# EAGLE schematic AtariST microATX (EAGLE 7.7.0)

## Sheet 1 of 3
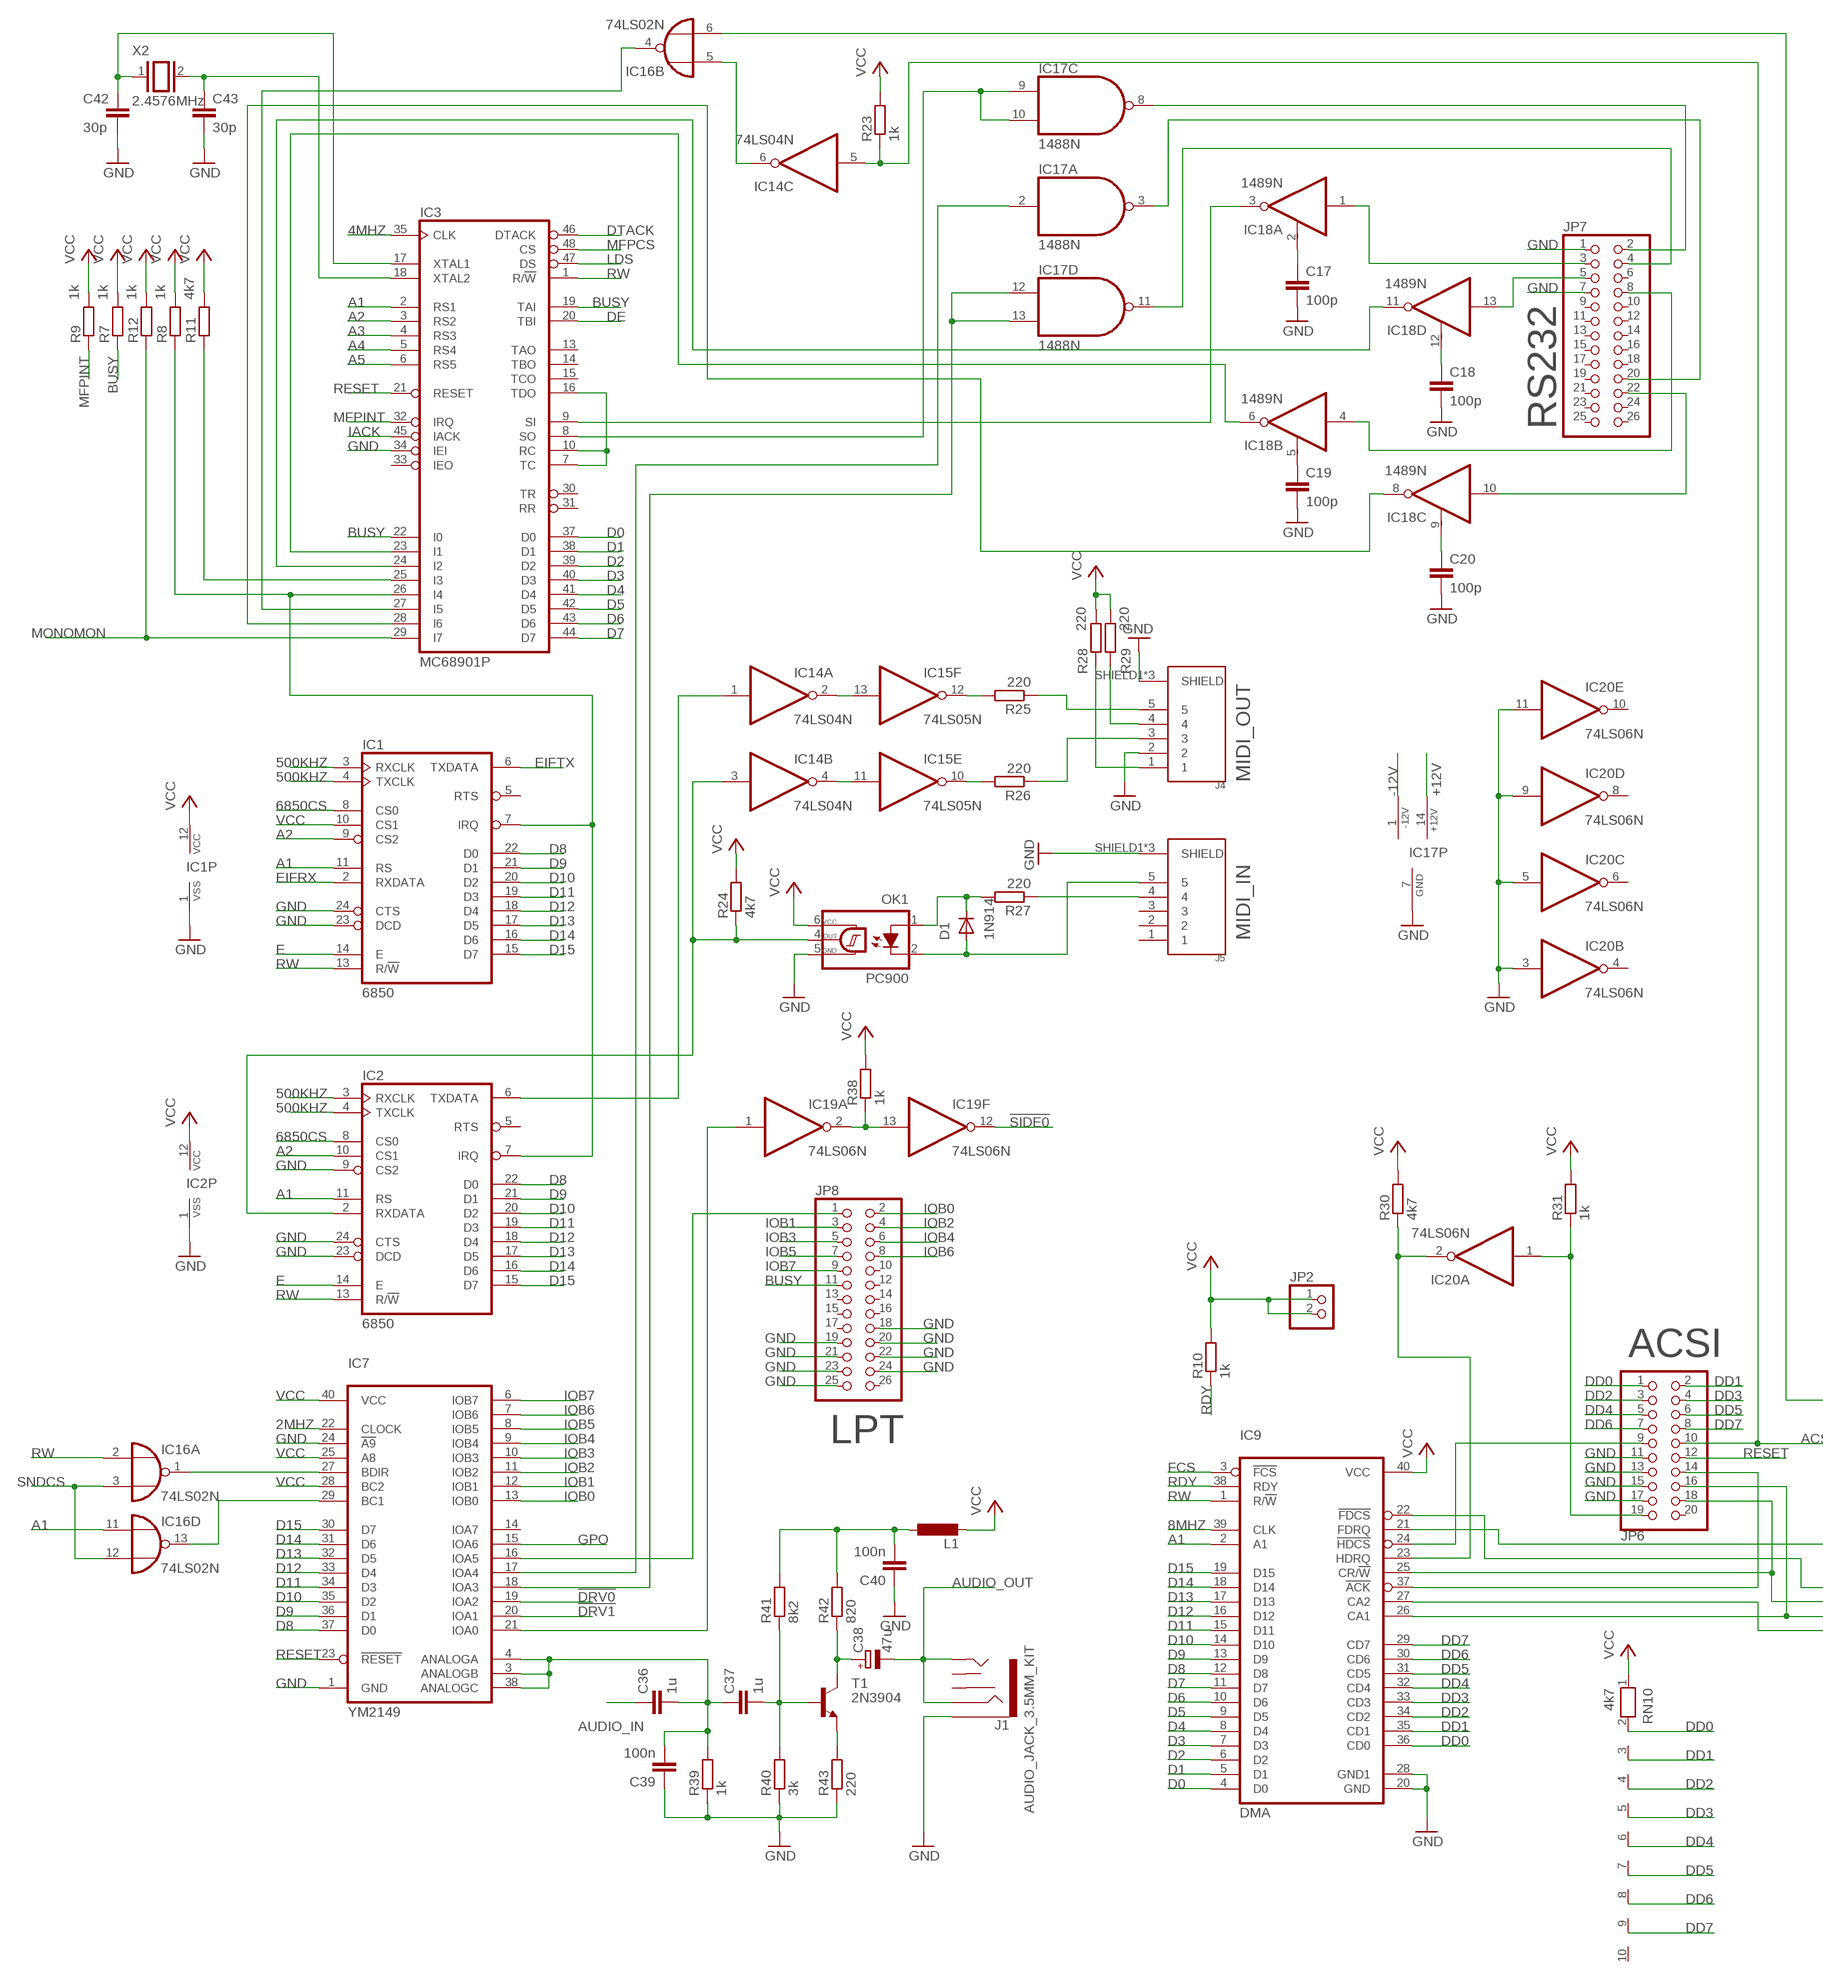
[diagram p0: schematic, sheet 1, part 1 of 2]
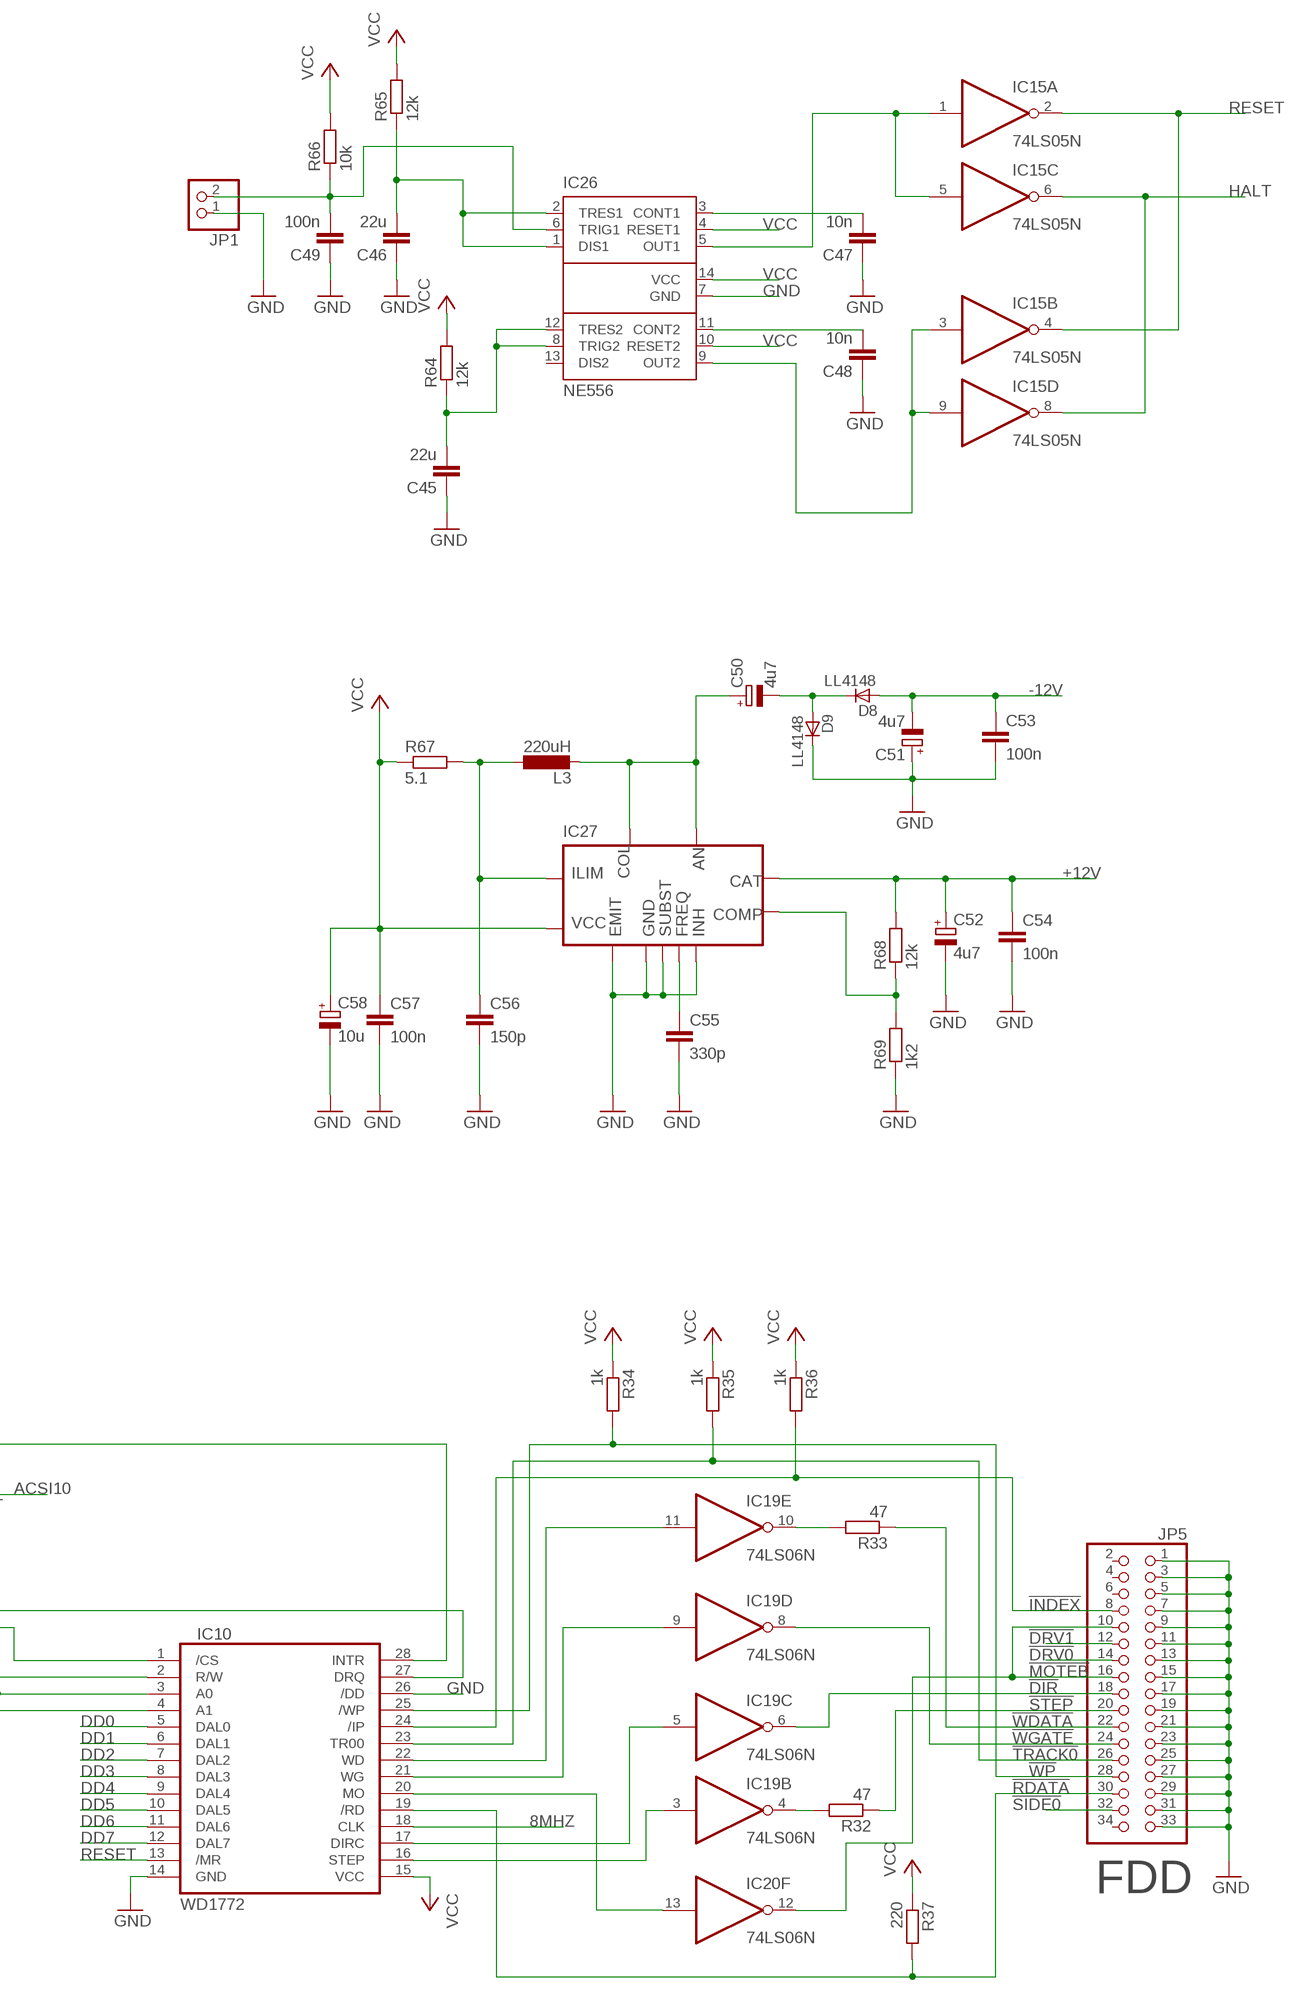
[diagram p1: schematic, sheet 1, part 2 of 2]

### Parts
C17  100p  C-EUC0805  [C0805]
C18  100p  C-EUC0805  [C0805]
C19  100p  C-EUC0805  [C0805]
C20  100p  C-EUC0805  [C0805]
C36  1u  C-EUC0805  [C0805]
C37  1u  C-EUC0805  [C0805]
C38  47u  CPOL-EUE2-5  [E2-5]
C39  100n  C-EUC0805  [C0805]
C40  100n  C-EUC0805  [C0805]
C42  30p  C-EUC0805  [C0805]
C43  30p  C-EUC0805  [C0805]
C45  22u  C-EUC1206  [C1206]
C46  22u  C-EUC1206  [C1206]
C47  10n  C-EUC0805  [C0805]
C48  10n  C-EUC0805  [C0805]
C49  100n  C-EUC0805  [C0805]
C50  4u7  CPOL-EUE2-5  [E2-5]
C51  4u7  CPOL-EUE2-5  [E2-5]
C52  4u7  CPOL-EUE2-5  [E2-5]
C53  100n  C-EUC0805  [C0805]
C54  100n  C-EUC0805  [C0805]
C55  330p  C-EUC0805  [C0805]
C56  150p  C-EUC0805  [C0805]
C57  100n  C-EUC0805  [C0805]
C58  10u  CPOL-EUE2-5  [E2-5]
D1  1N914  BAV17  [DO35-10]
D8  LL4148  [SOD80_DO213AA_MINIMELF]
D9  LL4148  [SOD80_DO213AA_MINIMELF]
IC1  6850  [DIL24]
IC2  6850  [DIL24]
IC3  MC68901P  [DIL48]
IC7  YM2149  [DIL40]
IC9  DMA  [DIL40]
IC10  WD1772  [DIL28]
IC14  74LS04N  [DIL14]
IC15  74LS05N  [DIL14]
IC16  74LS02N  [DIL14]
IC17  1488N  [DIL14]
IC18  1489N  [DIL14]
IC19  74LS06N  [DIL14]
IC20  74LS06N  [DIL14]
IC26  NE556  [DIL14]
IC27  TL497  [DIL14]
J1  AUDIO_JACK_3.5MM_KIT  [AUDIO-JACK-KIT]
J4  MIDI_OUT  DIN5  [DIN5]
J5  MIDI_IN  DIN5  [DIN5]
JP1  PINHD-1X2  [1X02]
JP2  PINHD-1X2  [1X02]
JP5  PINHD-2X17  [2X17]
JP6  PINHD-2X10  [2X10]
JP7  RS232  PINHD-2X13  [2X13]
JP8  LPT  PINHD-2X13  [2X13]
L1  L-EU0204/7  [0204/7]
L3  220uH  L-EU0204/7  [0204/7]
OK1  PC900  H11L1M  [DIL06]
R7  1k  R-EU_R0805  [R0805]
R8  1k  R-EU_R0805  [R0805]
R9  1k  R-EU_R0805  [R0805]
R10  1k  R-EU_R0805  [R0805]
R11  4k7  R-EU_R0805  [R0805]
R12  1k  R-EU_R0805  [R0805]
R23  1k  R-EU_R0805  [R0805]
R24  4k7  R-EU_R0805  [R0805]
R25  220  R-EU_R0805  [R0805]
R26  220  R-EU_R0805  [R0805]
R27  220  R-EU_R0805  [R0805]
R28  220  R-EU_R0805  [R0805]
R29  220  R-EU_R0805  [R0805]
R30  4k7  R-EU_R0805  [R0805]
R31  1k  R-EU_R0805  [R0805]
R32  47  R-EU_0204/5  [0204/5]
R33  47  R-EU_0204/5  [0204/5]
R34  1k  R-EU_R0805  [R0805]
R35  1k  R-EU_R0805  [R0805]
R36  1k  R-EU_R0805  [R0805]
R37  220  R-EU_R0805  [R0805]
R38  1k  R-EU_R0805  [R0805]
R39  1k  R-EU_R0805  [R0805]
R40  3k  R-EU_R0805  [R0805]
R41  8k2  R-EU_R0805  [R0805]
R42  820  R-EU_R0805  [R0805]
R43  220  R-EU_R0805  [R0805]
R64  12k  R-EU_R0805  [R0805]
R65  12k  R-EU_R0805  [R0805]
R66  10k  R-EU_R0805  [R0805]
R67  5.1  R-EU_0204/7  [0204/7]
R68  12k  R-EU_R0805  [R0805]
R69  1k2  R-EU_R0805  [R0805]
RN10  4k7  RN09  [RN-10]
T1  2N3904  [TO92]
X2  2.4576MHz  XTAL/S  [QS]

### Nets
2MHZ: IC7.22(CLOCK) ; also sheet 2
4MHZ: IC3.35(CLK) ; also sheet 2
8MHZ: IC9.39(CLK) IC10.18(CLK) ; also sheet 2,3
500KHZ: IC1.3(RXCLK) IC1.4(TXCLK) IC2.3(RXCLK) IC2.4(TXCLK) ; also sheet 2
6850CS: IC1.8(CS0) IC2.8(CS0) ; also sheet 2
!DIR: IC19.6(C:O) JP5.18
!DRV0: IC7.19(IOA2) JP5.14
!DRV1: IC7.20(IOA1) JP5.12
!INDEX: IC10.24(/IP) JP5.8 R36.2
!MOTEB: IC20.12(F:O) JP5.10 JP5.16
!RDATA: IC10.19(/RD) JP5.30 R37.2
!SIDE0: IC19.12(F:O) JP5.32
!STEP: JP5.20 R32.1
!TRACK0: IC10.23(TR00) JP5.26 R35.2
!WDATA: JP5.22 R33.1
!WGATE: IC19.8(D:O) JP5.24
!WP: IC10.25(/WP) JP5.28 R34.2
+12V: C52.+ C54.1 IC17.14(P:+12V) IC27.6(CAT) R68.2 ; also sheet 2
-12V: C51.- C53.1 D8.A IC17.1(P:-12V)
A1: IC1.11(RS) IC2.11(RS) IC3.2(RS1) IC9.2(A1) IC16.11(D:I0) ; also sheet 2,3
A2: IC1.9(CS2) IC2.10(CS1) IC3.3(RS2) ; also sheet 2,3
A3: IC3.4(RS3) ; also sheet 2,3
A4: IC3.5(RS4) ; also sheet 2,3
A5: IC3.6(RS5) ; also sheet 2,3
ACSI10: IC14.5(C:I) JP6.10 R23.1 ; also sheet 3
AUDIO_IN: C36.1 ; also sheet 2
AUDIO_OUT: C38.- J1.RING J1.TIP ; also sheet 2
BUSY: IC3.19(TAI) IC3.22(I0) JP8.11 R7.1
D0: IC3.37(D0) IC9.4(D0) ; also sheet 2,3
D1: IC3.38(D1) IC9.5(D1) ; also sheet 2,3
D2: IC3.39(D2) IC9.6(D2) ; also sheet 2,3
D3: IC3.40(D3) IC9.7(D3) ; also sheet 2,3
D4: IC3.41(D4) IC9.8(D4) ; also sheet 2,3
D5: IC3.42(D5) IC9.9(D5) ; also sheet 2,3
D6: IC3.43(D6) IC9.10(D6) ; also sheet 2,3
D7: IC3.44(D7) IC9.11(D7) ; also sheet 2,3
D8: IC1.22(D0) IC2.22(D0) IC7.37(D0) IC9.12(D8) ; also sheet 2,3
D9: IC1.21(D1) IC2.21(D1) IC7.36(D1) IC9.13(D9) ; also sheet 2,3
D10: IC1.20(D2) IC2.20(D2) IC7.35(D2) IC9.14(D10) ; also sheet 2,3
D11: IC1.19(D3) IC2.19(D3) IC7.34(D3) IC9.15(D11) ; also sheet 2,3
D12: IC1.18(D4) IC2.18(D4) IC7.33(D4) IC9.16(D12) ; also sheet 2,3
D13: IC1.17(D5) IC2.17(D5) IC7.32(D5) IC9.17(D13) ; also sheet 2,3
D14: IC1.16(D6) IC2.16(D6) IC7.31(D6) IC9.18(D14) ; also sheet 2,3
D15: IC1.15(D7) IC2.15(D7) IC7.30(D7) IC9.19(D15) ; also sheet 2,3
DD0: IC9.36(CD0) IC10.5(DAL0) JP6.1 RN10.2
DD1: IC9.35(CD1) IC10.6(DAL1) JP6.2 RN10.3
DD2: IC9.34(CD2) IC10.7(DAL2) JP6.3 RN10.4
DD3: IC9.33(CD3) IC10.8(DAL3) JP6.4 RN10.5
DD4: IC9.32(CD4) IC10.9(DAL4) JP6.5 RN10.6
DD5: IC9.31(CD5) IC10.10(DAL5) JP6.6 RN10.7
DD6: IC9.30(CD6) IC10.11(DAL6) JP6.7 RN10.8
DD7: IC9.29(CD7) IC10.12(DAL7) JP6.8 RN10.9
DE: IC3.20(TBI) ; also sheet 2
DTACK: IC3.46(DTACK) ; also sheet 2,3
E: IC1.14(E) IC2.14(E) ; also sheet 2
EIFRX: IC1.2(RXDATA) ; also sheet 3
EIFTX: IC1.6(TXDATA) ; also sheet 3
FCS: IC9.3(!FCS) ; also sheet 2
GND: C17.2 C18.2 C19.2 C20.2 C39.1 C40.1 C42.2 C43.2 C45.1 C46.1 C47.1 C48.1 C49.1 C51.+ C52.- C53.2 C54.2 C55.2 C56.2 C57.2 C58.- D9.C IC1.1(VSS) IC1.23(DCD) IC1.24(CTS) IC2.1(VSS) IC2.9(CS2) IC2.23(DCD) IC2.24(CTS) IC3.34(IEI) IC7.1(GND) IC7.24(!A9) IC9.20(GND) IC9.28(GND1) IC10.14(GND) IC10.26(/DD) IC17.7(P:GND) IC20.3(B:I) IC20.5(C:I) IC20.9(D:I) IC20.11(E:I) IC26.7(GND) IC27.2(INH) IC27.4(SUBST) IC27.5(GND) IC27.8(EMIT) J1.SLEEVE J4.2 J4.SHIELD1(SHIELD) J4.SHIELD2(SHIELD) J4.SHIELD3(SHIELD) J5.SHIELD1(SHIELD) J5.SHIELD2(SHIELD) J5.SHIELD3(SHIELD) JP1.1 JP5.1 JP5.3 JP5.5 JP5.7 JP5.9 JP5.11 JP5.13 JP5.15 JP5.17 JP5.19 JP5.21 JP5.23 JP5.25 JP5.27 JP5.29 JP5.31 JP5.33 JP6.11 JP6.13 JP6.15 JP6.17 JP7.1 JP7.7 JP8.18 JP8.19 JP8.20 JP8.21 JP8.22 JP8.23 JP8.24 JP8.25 OK1.5(GND) R39.1 R40.1 R43.1 R69.1 ; also sheet 2,3
GPO: IC7.15(IOA6) ; also sheet 2
HALT: IC15.6(C:O) IC15.8(D:O) ; also sheet 2
IACK: IC3.45(IACK) ; also sheet 2
IOB0: IC7.13(IOB0) JP8.2
IOB1: IC7.12(IOB1) JP8.3
IOB2: IC7.11(IOB2) JP8.4
IOB3: IC7.10(IOB3) JP8.5
IOB4: IC7.9(IOB4) JP8.6
IOB5: IC7.8(IOB5) JP8.7
IOB6: IC7.7(IOB6) JP8.8
IOB7: IC7.6(IOB7) JP8.9
LDS: IC3.47(DS) ; also sheet 2,3
MFPCS: IC3.48(CS) ; also sheet 2
MFPINT: IC3.32(IRQ) R9.1 ; also sheet 2
MONOMON: IC3.29(I7) R12.1 ; also sheet 2
N$18: C48.2 IC26.11(CONT2)
N$21: IC7.16(IOA5) JP8.1
N$22: IC7.27(BDIR) IC16.1(A:O)
N$23: IC7.29(BC1) IC16.13(D:O)
N$24: IC1.7(IRQ) IC2.7(IRQ) IC3.26(I4) R8.1
N$27: IC3.7(TC) IC3.10(RC) IC3.16(TDO)
N$28: IC3.9(SI) IC18.3(A:O)
N$30: IC3.8(SO) IC17.9(C:I0) IC17.10(C:I1)
N$31: IC3.25(I3) R11.1
N$50: IC17.8(C:O) JP7.2
N$51: IC18.1(A:I) JP7.3
N$52: IC17.11(D:O) JP7.4
N$53: IC18.13(D:I) JP7.5
N$54: IC18.4(B:I) JP7.8
N$55: IC18.10(C:I) JP7.22
N$56: IC17.3(A:O) JP7.20
N$57: C19.1 IC18.5(B:RC)
N$58: C20.1 IC18.9(C:RC)
N$59: C18.1 IC18.12(D:RC)
N$60: C17.1 IC18.2(A:RC)
N$61: IC3.24(I2) IC18.11(D:O)
N$62: IC3.23(I1) IC18.6(B:O)
N$63: IC3.28(I6) IC18.8(C:O)
N$64: IC7.17(IOA4) IC17.2(A:I)
N$65: IC7.18(IOA3) IC17.12(D:I0) IC17.13(D:I1)
N$66: IC10.28(INTR) IC16.6(B:I1)
N$67: IC14.6(C:O) IC16.5(B:I0)
N$69: IC3.27(I5) IC16.4(B:O)
N$70: IC2.6(TXDATA) IC14.1(A:I)
N$71: IC2.2(RXDATA) IC14.3(B:I) OK1.4(OUT) R24.1
N$72: IC14.2(A:O) IC15.13(F:I)
N$73: IC14.4(B:O) IC15.11(E:I)
N$74: J4.1 R28.1
N$75: J4.4 R29.1
N$76: IC9.26(CA1) IC10.3(A0) JP6.16
N$77: J4.5 R25.1
N$78: J4.3 R26.1
N$79: IC15.10(E:O) R26.2
N$80: IC15.12(F:O) R25.2
N$81: J5.4 R27.1
N$82: D1.C OK1.1(A) R27.2
N$83: D1.A J5.5 OK1.2(C)
N$84: IC9.27(CA2) IC10.4(A1)
N$85: IC9.25(CR/!W) IC10.2(R/W) JP6.18
N$86: IC9.22(!FDCS) IC10.1(/CS)
N$87: IC9.21(FDRQ) IC10.27(DRQ)
N$88: IC9.24(!HDCS) JP6.9
N$89: IC9.37(!ACK) JP6.14
N$90: IC20.1(A:I) JP6.19 R31.1
N$91: IC9.23(HDRQ) IC20.2(A:O) R30.1
N$92: IC10.17(DIRC) IC19.5(C:I)
N$93: IC19.4(B:O) R32.2
N$94: IC10.20(MO) IC20.13(F:I)
N$95: IC7.21(IOA0) IC19.1(A:I)
N$96: IC19.2(A:O) IC19.13(F:I) R38.1
N$97: C36.2 C37.1 C39.2 IC7.3(ANALOGB) IC7.4(ANALOGA) IC7.38(ANALOGC) R39.2
N$98: IC10.16(STEP) IC19.3(B:I)
N$99: IC10.22(WD) IC19.11(E:I)
N$100: IC10.21(WG) IC19.9(D:I)
N$101: IC19.10(E:O) R33.2
N$103: C37.2 R40.2 R41.1 T1.2(B)
N$105: C38.+ R42.1 T1.1(C)
N$106: R43.2 T1.3(E)
N$107: C42.1 IC3.17(XTAL1) X2.1
N$108: C43.1 IC3.18(XTAL2) X2.2
N$109: C40.2 L1.1 R41.2 R42.2
N$112: C47.2 IC26.3(CONT1)
N$113: C45.2 IC26.8(TRIG2) IC26.12(TRES2) R64.1
N$115: C56.1 IC27.13(ILIM) L3.1 R67.2
N$116: C46.2 IC26.1(DIS1) IC26.2(TRES1) R65.1
N$118: C50.+ IC27.7(AN) IC27.10(COL) L3.2
N$125: C49.2 IC26.6(TRIG1) JP1.2 R66.1
N$127: C50.- D8.C D9.A
N$128: IC15.1(A:I) IC15.5(C:I) IC26.5(OUT1)
N$129: IC15.3(B:I) IC15.9(D:I) IC26.9(OUT2)
N$131: IC27.1(COMP) R68.1 R69.2
N$133: C55.1 IC27.3(FREQ)
RDY: IC9.38(RDY) R10.1 ; also sheet 2
RESET: IC3.21(RESET) IC7.23(!RESET) IC10.13(/MR) IC15.2(A:O) IC15.4(B:O) JP6.12 ; also sheet 2,3
RW: IC1.13(R/!W) IC2.13(R/!W) IC3.1(R/!W) IC9.1(R/!W) IC16.2(A:I0) ; also sheet 2,3
SNDCS: IC16.3(A:I1) IC16.12(D:I1) ; also sheet 2
VCC: C57.1 C58.+ IC1.10(CS1) IC1.12(VCC) IC2.12(VCC) IC7.25(A8) IC7.28(BC2) IC7.40(VCC) IC9.40(VCC) IC10.15(VCC) IC26.4(RESET1) IC26.10(RESET2) IC26.14(VCC) IC27.14(VCC) JP2.1 JP2.2 L1.2 OK1.6(VCC) R7.2 R8.2 R9.2 R10.2 R11.2 R12.2 R23.2 R24.2 R28.2 R29.2 R30.2 R31.2 R34.1 R35.1 R36.1 R37.1 R38.2 R64.2 R65.2 R66.2 R67.1 RN10.1 ; also sheet 2,3
Unconnected: IC1.5(RTS) IC2.5(RTS) IC3.13(TAO) IC3.14(TBO) IC3.15(TCO) IC3.30(TR) IC3.31(RR) IC3.33(IEO) IC7.14(IOA7) IC14.8(D:O) IC14.9(D:I) IC14.10(E:O) IC14.11(E:I) IC14.12(F:O) IC14.13(F:I) IC16.8(C:I0) IC16.9(C:I1) IC16.10(C:O) IC17.4(B:I0) IC17.5(B:I1) IC17.6(B:O) IC20.4(B:O) IC20.6(C:O) IC20.8(D:O) IC20.10(E:O) IC26.13(DIS2) J1.RSH J1.TSH J5.1 J5.3 JP5.2 JP5.4 JP5.6 JP5.34 JP6.20 JP7.6 JP7.9 JP7.10 JP7.11 JP7.12 JP7.13 JP7.14 JP7.15 JP7.16 JP7.17 JP7.18 JP7.19 JP7.21 JP7.23 JP7.24 JP7.25 JP7.26 JP8.10 JP8.12 JP8.13 JP8.14 JP8.15 JP8.16 JP8.17 JP8.26 RN10.10

### Notes on the sheet
- ACSI
- FDD

## Sheet 2 of 3
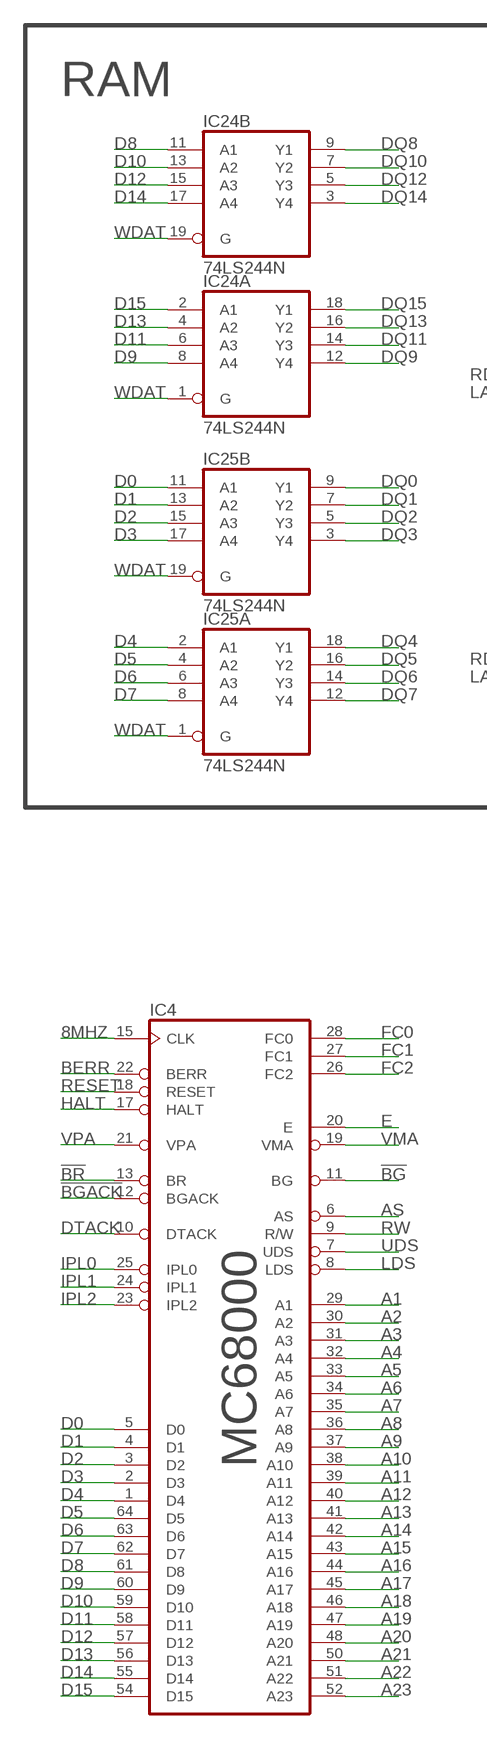
[diagram p2: schematic, sheet 2, part 1 of 2]
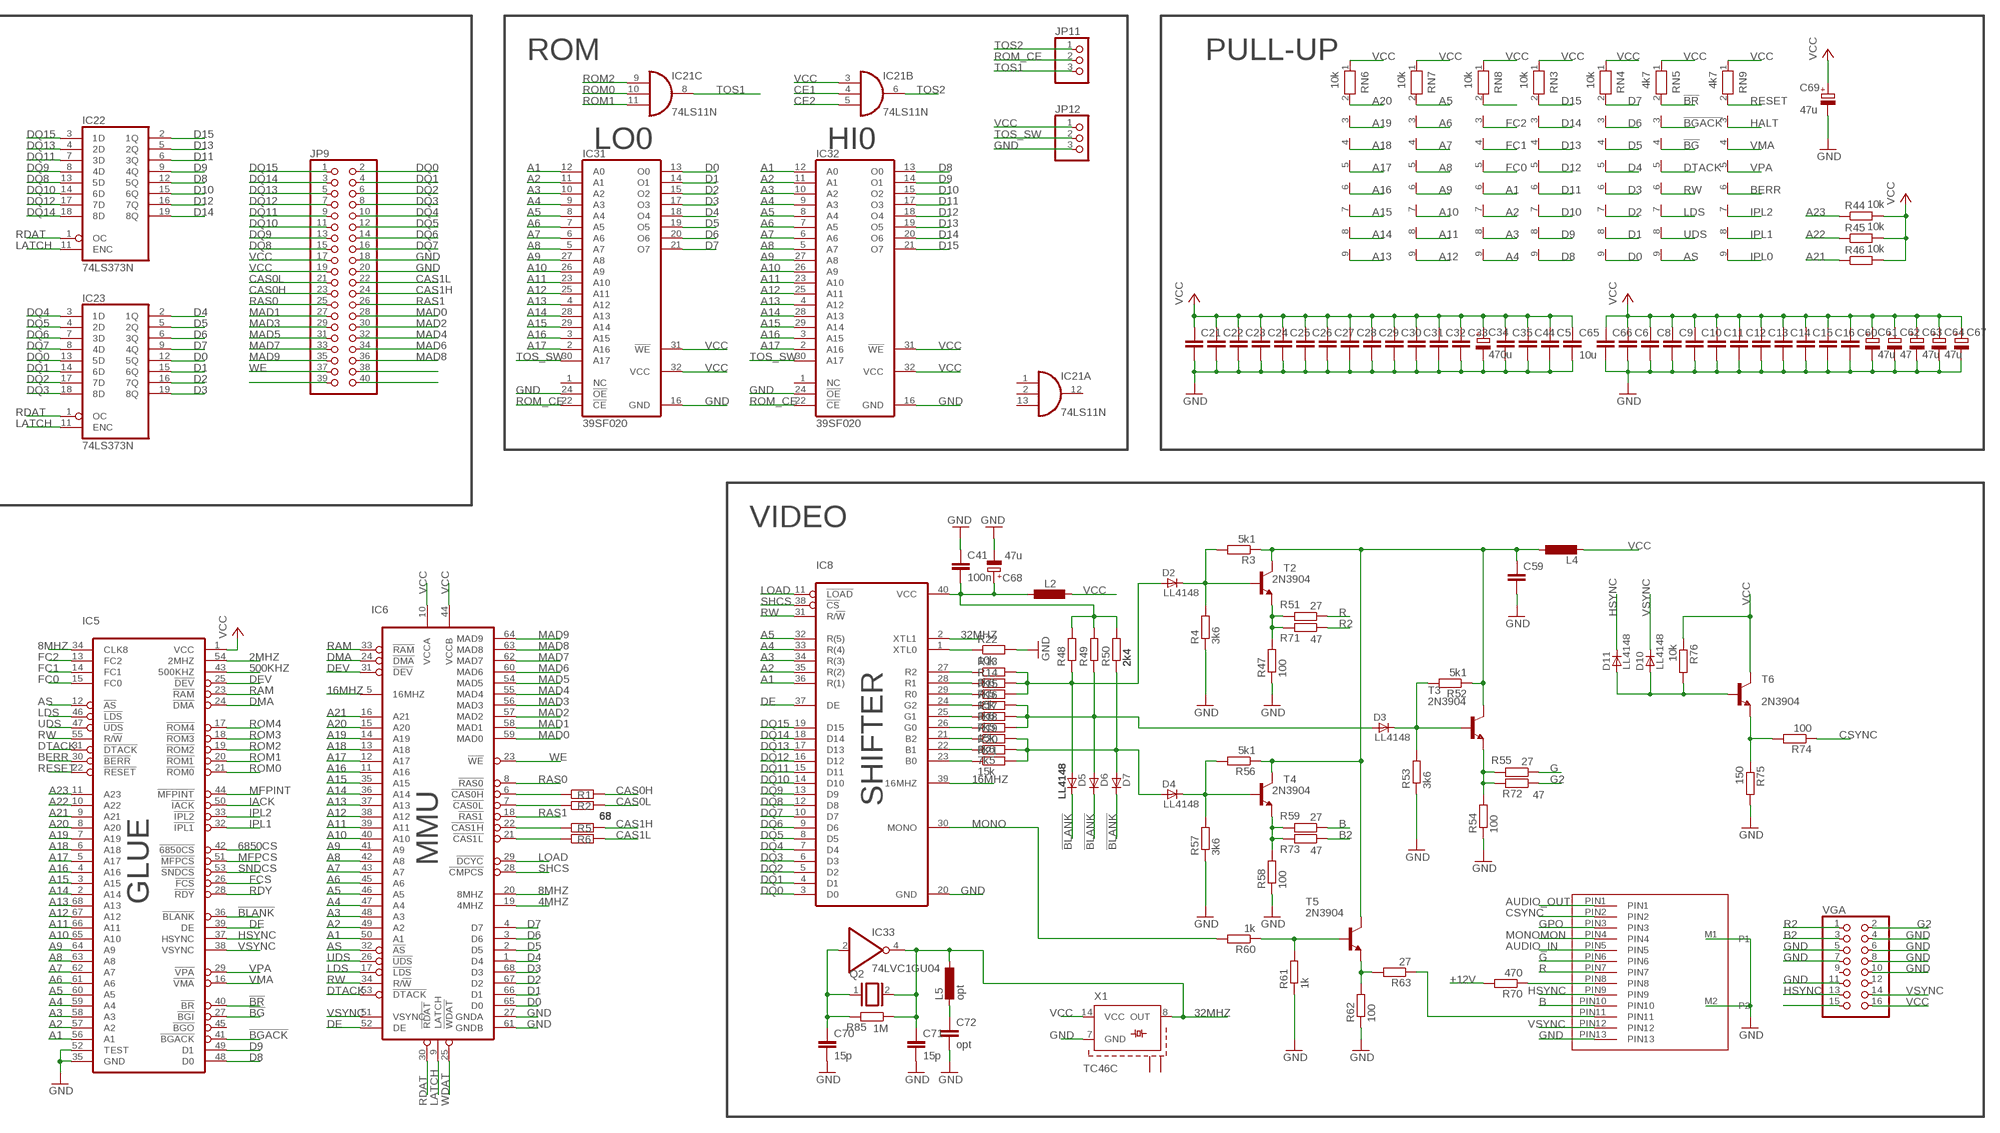
[diagram p3: schematic, sheet 2, part 2 of 2]

### Parts
C5  C-EU050-025X075  [C050-025X075]
C6  C-EUC0805  [C0805]
C8  C-EUC0805  [C0805]
C9  C-EUC0805  [C0805]
C10  C-EUC0805  [C0805]
C11  C-EUC0805  [C0805]
C12  C-EUC0805  [C0805]
C13  C-EUC0805  [C0805]
C14  C-EUC0805  [C0805]
C15  C-EUC0805  [C0805]
C16  C-EU050-025X075  [C050-025X075]
C21  C-EUC0805  [C0805]
C22  C-EUC0805  [C0805]
C23  C-EUC0805  [C0805]
C24  C-EUC0805  [C0805]
C25  C-EU050-025X075  [C050-025X075]
C26  C-EU075-032X103  [C075-032X103]
C27  C-EUC0805  [C0805]
C28  C-EU050-025X075  [C050-025X075]
C29  C-EU050-025X075  [C050-025X075]
C30  C-EU050-025X075  [C050-025X075]
C31  C-EUC0805  [C0805]
C32  C-EU050-025X075  [C050-025X075]
C33  C-EU050-025X075  [C050-025X075]
C34  470u  CPOL-EUE3.5-8  [E3,5-8]
C35  C-EUC0805  [C0805]
C41  100n  C-EU050-025X075  [C050-025X075]
C44  C-EUC0805  [C0805]
C59  C-EU050-025X075  [C050-025X075]
C60  C-EUC0805  [C0805]
C61  47u  CPOL-EUE2-5  [E2-5]
C62  47  CPOL-EUE2-5  [E2-5]
C63  47u  CPOL-EUE2-5  [E2-5]
C64  47u  CPOL-EUE2-5  [E2-5]
C65  10u  C-EUC0805  [C0805]
C66  C-EUC0805  [C0805]
C67  CPOL-EUC/6032-28R  [C/6032-28R]
C68  47u  CPOL-EUE2.5-5  [E2,5-5]
C69  47u  CPOL-EUE2.5-5  [E2,5-5]
C70  15p  C-EUC0805  [C0805]
C71  15p  C-EUC0805  [C0805]
C72  opt  C-EUC0805  [C0805]
D2  LL4148  [SOD80_DO213AA_MINIMELF]
D3  LL4148  [SOD80_DO213AA_MINIMELF]
D4  LL4148  [SOD80_DO213AA_MINIMELF]
D5  LL4148  [SOD80_DO213AA_MINIMELF]
D6  LL4148  [SOD80_DO213AA_MINIMELF]
D7  LL4148  [SOD80_DO213AA_MINIMELF]
D10  LL4148  [SOD80_DO213AA_MINIMELF]
D11  LL4148  [SOD80_DO213AA_MINIMELF]
IC4  MC68000  MC68000P  [DIL64]
IC5  GLUE  [PLCC68]
IC6  MMU  [PLCC68]
IC8  SHIFTER  [DIL40]
IC21  74LS11N  [DIL14]
IC22  74LS373N  [DIL20]
IC23  74LS373N  [DIL20]
IC24  74LS244N  [DIL20]
IC25  74LS244N  [DIL20]
IC31  39SF020  [DIL32]
IC32  39SF020  [DIL32]
IC33  74LVC1GU04  74AHCT1G04DBV  [SOT23-5]
JP9  PINHD-2X20  [2X20]
JP11  PINHD-1X3  [1X03]
JP12  PINHD-1X3  [1X03]
L2  L-EU0204/7  [0204/7]
L4  L-EU0204/7  [0204/7]
L5  opt  L-EU0204/7  [0204/7]
Q2  XTAL/S  [QS]
R1  68  R-EU_R0805  [R0805]
R2  68  R-EU_R0805  [R0805]
R3  5k1  R-EU_R0805  [R0805]
R4  3k6  R-EU_R0805  [R0805]
R5  68  R-EU_R0805  [R0805]
R6  68  R-EU_R0805  [R0805]
R13  3k6  R-EU_0204/5  [0204/5]
R14  7k5  R-EU_0204/5  [0204/5]
R15  15k  R-EU_0204/5  [0204/5]
R16  3k6  R-EU_0204/5  [0204/5]
R17  7k5  R-EU_0204/5  [0204/5]
R18  15k  R-EU_0204/5  [0204/5]
R19  3k6  R-EU_0204/5  [0204/5]
R20  7k5  R-EU_0204/5  [0204/5]
R21  15k  R-EU_0204/5  [0204/5]
R22  10k  R-EU_R0805  [R0805]
R44  10k  R-EU_R0805  [R0805]
R45  10k  R-EU_R0805  [R0805]
R46  10k  R-EU_R0805  [R0805]
R47  100  R-EU_R0805  [R0805]
R48  2k4  R-EU_R0805  [R0805]
R49  2k4  R-EU_R0805  [R0805]
R50  2k4  R-EU_R0805  [R0805]
R51  27  R-EU_R0805  [R0805]
R52  5k1  R-EU_R0805  [R0805]
R53  3k6  R-EU_R0805  [R0805]
R54  100  R-EU_R0805  [R0805]
R55  27  R-EU_R0805  [R0805]
R56  5k1  R-EU_R0805  [R0805]
R57  3k6  R-EU_R0805  [R0805]
R58  100  R-EU_R0805  [R0805]
R59  27  R-EU_R0805  [R0805]
R60  1k  R-EU_R0805  [R0805]
R61  1k  R-EU_R0805  [R0805]
R62  100  R-EU_R0805  [R0805]
R63  27  R-EU_R0805  [R0805]
R70  470  R-EU_R0805  [R0805]
R71  47  R-EU_R0805  [R0805]
R72  47  R-EU_R0805  [R0805]
R73  47  R-EU_R0805  [R0805]
R74  100  R-EU_R0805  [R0805]
R75  150  R-EU_R0805  [R0805]
R76  10k  R-EU_R0805  [R0805]
R85  1M  R-EU_R0805  [R0805]
RN3  10k  RN08  [RN-9]
RN4  10k  RN08  [RN-9]
RN5  4k7  RN08  [RN-9]
RN6  10k  RN08  [RN-9]
RN7  10k  RN08  [RN-9]
RN8  10k  RN08  [RN-9]
RN9  4k7  RN08  [RN-9]
T2  2N3904  [TO92]
T3  2N3904  [TO92]
T4  2N3904  [TO92]
T5  2N3904  [TO92]
T6  2N3904  [TO92]
U$6  Monitor  13-DIN13PINDIN  [DIN-13]
VGA  PINHD-2X8  [2X08]
X1  TC46C  [TC46]

### Nets
2MHZ: IC5.54(2MHZ) ; also sheet 1
4MHZ: IC6.19(4MHZ) ; also sheet 1
8MHZ: IC4.15(CLK) IC5.34(CLK8) IC6.20(8MHZ) ; also sheet 1,3
16MHZ: IC6.5(16MHZ) IC8.39(16MHZ)
32MHZ: C71.1 IC8.2(XTL1) IC33.4(O) L5.1 Q2.2 R85.1 X1.8(OUT)
500KHZ: IC5.43(500KHZ) ; also sheet 1
6850CS: IC5.42(!6850CS) ; also sheet 1
!BG: IC4.11(BG) IC5.27(!BGI) RN5.4
!BGACK: IC4.12(BGACK) IC5.41(!BGACK) RN5.3
!BLANK: D5.C D6.C D7.C IC5.36(!BLANK)
!BR: IC4.13(BR) IC5.40(!BR) RN5.2
+12V: R70.2 ; also sheet 1
A1: IC4.29(A1) IC5.56(A1) IC6.50(A1) IC8.36(R(1)) IC31.12(A0) IC32.12(A0) RN8.6 ; also sheet 1,3
A2: IC4.30(A2) IC5.57(A2) IC6.49(A2) IC8.35(R(2)) IC31.11(A1) IC32.11(A1) RN8.7 ; also sheet 1,3
A3: IC4.31(A3) IC5.58(A3) IC6.48(A3) IC8.34(R(3)) IC31.10(A2) IC32.10(A2) RN8.8 ; also sheet 1,3
A4: IC4.32(A4) IC5.59(A4) IC6.47(A4) IC8.33(R(4)) IC31.9(A3) IC32.9(A3) RN8.9 ; also sheet 1,3
A5: IC4.33(A5) IC5.60(A5) IC6.46(A5) IC8.32(R(5)) IC31.8(A4) IC32.8(A4) RN7.2 ; also sheet 1,3
A6: IC4.34(A6) IC5.61(A6) IC6.45(A6) IC31.7(A5) IC32.7(A5) RN7.3 ; also sheet 3
A7: IC4.35(A7) IC5.62(A7) IC6.43(A7) IC31.6(A6) IC32.6(A6) RN7.4 ; also sheet 3
A8: IC4.36(A8) IC5.63(A8) IC6.42(A8) IC31.5(A7) IC32.5(A7) RN7.5 ; also sheet 3
A9: IC4.37(A9) IC5.64(A9) IC6.41(A9) IC31.27(A8) IC32.27(A8) RN7.6 ; also sheet 3
A10: IC4.38(A10) IC5.65(A10) IC6.40(A10) IC31.26(A9) IC32.26(A9) RN7.7 ; also sheet 3
A11: IC4.39(A11) IC5.66(A11) IC6.39(A11) IC31.23(A10) IC32.23(A10) RN7.8 ; also sheet 3
A12: IC4.40(A12) IC5.67(A12) IC6.38(A12) IC31.25(A11) IC32.25(A11) RN7.9 ; also sheet 3
A13: IC4.41(A13) IC5.68(A13) IC6.37(A13) IC31.4(A12) IC32.4(A12) RN6.9 ; also sheet 3
A14: IC4.42(A14) IC5.2(A14) IC6.36(A14) IC31.28(A13) IC32.28(A13) RN6.8 ; also sheet 3
A15: IC4.43(A15) IC5.3(A15) IC6.35(A15) IC31.29(A14) IC32.29(A14) RN6.7 ; also sheet 3
A16: IC4.44(A16) IC5.4(A16) IC6.11(A16) IC31.3(A15) IC32.3(A15) RN6.6 ; also sheet 3
A17: IC4.45(A17) IC5.5(A17) IC6.12(A17) IC31.2(A16) IC32.2(A16) RN6.5 ; also sheet 3
A18: IC4.46(A18) IC5.6(A18) IC6.13(A18) RN6.4 ; also sheet 3
A19: IC4.47(A19) IC5.7(A19) IC6.14(A19) RN6.3 ; also sheet 3
A20: IC4.48(A20) IC5.8(A20) IC6.15(A20) RN6.2 ; also sheet 3
A21: IC4.50(A21) IC5.9(A21) IC6.16(A21) R46.1 ; also sheet 3
A22: IC4.51(A22) IC5.10(A22) R45.1 ; also sheet 3
A23: IC4.52(A23) IC5.11(A23) R44.1 ; also sheet 3
AS: IC4.6(AS) IC5.12(!AS) IC6.32(!AS) RN5.9 ; also sheet 3
AUDIO_IN: U$6.PIN5 ; also sheet 1
AUDIO_OUT: U$6.PIN1 ; also sheet 1
B: R59.1 U$6.PIN10
B2: R73.1 VGA.3
BERR: IC4.22(BERR) IC5.30(!BERR) RN9.6
CAS0H: JP9.23 R1.2
CAS0L: JP9.21 R2.2
CAS1H: JP9.24 R5.2
CAS1L: JP9.22 R6.2
CE1: IC21.4(B:I1) ; also sheet 3
CE2: IC21.5(B:I2) ; also sheet 3
CSYNC: R74.1 U$6.PIN2
D0: IC4.5(D0) IC6.65(D0) IC23.12(5Q) IC25.11(B:A1) IC31.13(O0) RN4.9 ; also sheet 1,3
D1: IC4.4(D1) IC6.66(D1) IC23.15(6Q) IC25.13(B:A2) IC31.14(O1) RN4.8 ; also sheet 1,3
D2: IC4.3(D2) IC6.67(D2) IC23.16(7Q) IC25.15(B:A3) IC31.15(O2) RN4.7 ; also sheet 1,3
D3: IC4.2(D3) IC6.68(D3) IC23.19(8Q) IC25.17(B:A4) IC31.17(O3) RN4.6 ; also sheet 1,3
D4: IC4.1(D4) IC6.1(D4) IC23.2(1Q) IC25.2(A:A1) IC31.18(O4) RN4.5 ; also sheet 1,3
D5: IC4.64(D5) IC6.2(D5) IC23.5(2Q) IC25.4(A:A2) IC31.19(O5) RN4.4 ; also sheet 1,3
D6: IC4.63(D6) IC6.3(D6) IC23.6(3Q) IC25.6(A:A3) IC31.20(O6) RN4.3 ; also sheet 1,3
D7: IC4.62(D7) IC6.4(D7) IC23.9(4Q) IC25.8(A:A4) IC31.21(O7) RN4.2 ; also sheet 1,3
D8: IC4.61(D8) IC5.48(D0) IC22.12(5Q) IC24.11(B:A1) IC32.13(O0) RN3.9 ; also sheet 1,3
D9: IC4.60(D9) IC5.49(D1) IC22.9(4Q) IC24.8(A:A4) IC32.14(O1) RN3.8 ; also sheet 1,3
D10: IC4.59(D10) IC22.15(6Q) IC24.13(B:A2) IC32.15(O2) RN3.7 ; also sheet 1,3
D11: IC4.58(D11) IC22.6(3Q) IC24.6(A:A3) IC32.17(O3) RN3.6 ; also sheet 1,3
D12: IC4.57(D12) IC22.16(7Q) IC24.15(B:A3) IC32.18(O4) RN3.5 ; also sheet 1,3
D13: IC4.56(D13) IC22.5(2Q) IC24.4(A:A2) IC32.19(O5) RN3.4 ; also sheet 1,3
D14: IC4.55(D14) IC22.19(8Q) IC24.17(B:A4) IC32.20(O6) RN3.3 ; also sheet 1,3
D15: IC4.54(D15) IC22.2(1Q) IC24.2(A:A1) IC32.21(O7) RN3.2 ; also sheet 1,3
DE: IC5.39(DE) IC6.52(DE) IC8.37(DE) ; also sheet 1
DEV: IC5.25(!DEV) IC6.31(!DEV)
DMA: IC5.24(!DMA) IC6.24(!DMA)
DQ0: IC8.3(D0) IC23.13(5D) IC25.9(B:Y1) JP9.2
DQ1: IC8.4(D1) IC23.14(6D) IC25.7(B:Y2) JP9.4
DQ2: IC8.5(D2) IC23.17(7D) IC25.5(B:Y3) JP9.6
DQ3: IC8.6(D3) IC23.18(8D) IC25.3(B:Y4) JP9.8
DQ4: IC8.7(D4) IC23.3(1D) IC25.18(A:Y1) JP9.10
DQ5: IC8.8(D5) IC23.4(2D) IC25.16(A:Y2) JP9.12
DQ6: IC8.9(D6) IC23.7(3D) IC25.14(A:Y3) JP9.14
DQ7: IC8.10(D7) IC23.8(4D) IC25.12(A:Y4) JP9.16
DQ8: IC8.12(D8) IC22.13(5D) IC24.9(B:Y1) JP9.15
DQ9: IC8.13(D9) IC22.8(4D) IC24.12(A:Y4) JP9.13
DQ10: IC8.14(D10) IC22.14(6D) IC24.7(B:Y2) JP9.11
DQ11: IC8.15(D11) IC22.7(3D) IC24.14(A:Y3) JP9.9
DQ12: IC8.16(D12) IC22.17(7D) IC24.5(B:Y3) JP9.7
DQ13: IC8.17(D13) IC22.4(2D) IC24.16(A:Y2) JP9.5
DQ14: IC8.18(D14) IC22.18(8D) IC24.3(B:Y4) JP9.3
DQ15: IC8.19(D15) IC22.3(1D) IC24.18(A:Y1) JP9.1
DTACK: IC4.10(DTACK) IC5.31(!DTACK) IC6.53(!DTACK) RN5.5 ; also sheet 1,3
E: IC4.20(E) ; also sheet 1
FC0: IC4.28(FC0) IC5.15(FC0) RN8.5
FC1: IC4.27(FC1) IC5.14(FC1) RN8.4
FC2: IC4.26(FC2) IC5.13(FC2) RN8.3
FCS: IC5.26(!FCS) ; also sheet 1
G: R55.1 U$6.PIN6
G2: R72.1 VGA.2
GND: C5.2 C6.2 C8.2 C9.2 C10.2 C11.2 C12.2 C13.2 C14.2 C15.2 C16.2 C21.2 C22.2 C23.2 C24.2 C25.2 C26.2 C27.2 C28.2 C29.2 C30.2 C31.2 C32.2 C33.2 C34.- C35.2 C41.1 C44.2 C59.2 C60.2 C61.- C62.- C63.- C64.- C65.2 C66.2 C67.- C68.- C69.- C70.2 C71.2 C72.2 IC5.35(GND) IC5.52(TEST) IC6.27(GNDA) IC6.61(GNDB) IC8.20(GND) IC31.16(GND) IC31.24(!OE) IC32.16(GND) IC32.24(!OE) JP9.18 JP9.20 JP12.3 R4.1 R22.2 R47.1 R53.1 R54.1 R57.1 R58.1 R61.1 R62.1 R75.2 U$6.M1(P1) U$6.M2(P2) U$6.PIN13 VGA.4 VGA.5 VGA.6 VGA.7 VGA.8 VGA.10 VGA.11 X1.7(GND) ; also sheet 1,3
GPO: U$6.PIN3 ; also sheet 1
HALT: IC4.17(HALT) RN9.3 ; also sheet 1
HSYNC: D11.C IC5.37(HSYNC) U$6.PIN9 VGA.13
IACK: IC5.50(!IACK) ; also sheet 1
IPL0: IC4.25(IPL0) RN9.9
IPL1: IC4.24(IPL1) IC5.32(!IPL1) RN9.8
IPL2: IC4.23(IPL2) IC5.33(!IPL2) RN9.7
LATCH: IC6.9(LATCH) IC22.11(ENC) IC23.11(ENC)
LDS: IC4.8(LDS) IC5.46(!LDS) IC6.17(!LDS) RN5.7 ; also sheet 1,3
LOAD: IC6.29(!DCYC) IC8.11(!LOAD)
MAD0: IC6.59(MAD0) JP9.28
MAD1: IC6.58(MAD1) JP9.27
MAD2: IC6.57(MAD2) JP9.30
MAD3: IC6.56(MAD3) JP9.29
MAD4: IC6.55(MAD4) JP9.32
MAD5: IC6.54(MAD5) JP9.31
MAD6: IC6.60(MAD6) JP9.34
MAD7: IC6.62(MAD7) JP9.33
MAD8: IC6.63(MAD8) JP9.36
MAD9: IC6.64(MAD9) JP9.35
MFPCS: IC5.51(!MFPCS) ; also sheet 1
MFPINT: IC5.44(!MFPINT) ; also sheet 1
MONO: IC8.30(MONO) R60.2
MONOMON: U$6.PIN4 ; also sheet 1
N$6: C41.2 C68.+ IC8.40(VCC) L2.1 R48.2 R49.2 R50.2
N$17: D2.C R3.2 R4.2 T2.2(B)
N$25: R70.1 U$6.PIN8
N$32: IC8.1(XTL0) R22.1
N$33: IC8.27(R2) R13.1
N$34: IC8.28(R1) R14.1
N$35: IC8.29(R0) R15.1
N$36: IC6.6(!CAS0H) R1.1
N$37: IC6.7(!CAS0L) R2.1
N$38: IC8.24(G2) R16.1
N$39: IC6.22(!CAS1H) R5.1
N$40: IC6.21(!CAS1L) R6.1
N$41: IC8.25(G1) R17.1
N$42: IC8.26(G0) R18.1
N$43: IC8.21(B2) R19.1
N$44: RN8.2
N$45: IC8.22(B1) R20.1
N$46: IC8.23(B0) R21.1
N$47: D2.A D5.A R13.2 R14.2 R15.2 R48.1
N$48: D3.A D6.A R16.2 R17.2 R18.2 R49.1
N$49: D4.A D7.A R19.2 R20.2 R21.2 R50.1
N$102: R47.2 R51.2 R71.2 T2.3(E)
N$110: D3.C R52.2 R53.2 T3.2(B)
N$114: R54.2 R55.2 R72.2 T3.3(E)
N$117: R63.1 U$6.PIN11
N$119: R60.1 R61.2 T5.2(B)
N$120: D4.C R56.2 R57.2 T4.2(B)
N$121: D10.A D11.A R76.2 T6.2(B)
N$122: R58.2 R59.2 R73.2 T4.3(E)
N$123: C59.1 L4.1 R3.1 R52.1 R56.1 T2.1(C) T3.1(C) T4.1(C) T5.1(C)
N$124: R62.2 R63.2 T5.3(E)
N$126: R74.2 R75.1 T6.3(E)
N$140: VGA.15
N$142: C70.1 IC33.2(I) Q2.1 R85.2
N$143: C72.1 L5.2
N$153: JP9.39
N$172: JP9.38
N$173: JP9.40
R: R51.1 U$6.PIN7
R2: R71.1 VGA.1
RAM: IC5.23(!RAM) IC6.33(!RAM)
RAS0: IC6.8(!RAS0) JP9.25
RAS1: IC6.18(!RAS1) JP9.26
RDAT: IC6.30(!RDAT) IC22.1(OC) IC23.1(OC)
RDY: IC5.28(!RDY) ; also sheet 1
RESET: IC4.18(RESET) IC5.22(!RESET) RN9.2 ; also sheet 1,3
ROM0: IC5.21(!ROM0) IC21.10(C:I1)
ROM1: IC5.20(!ROM1) IC21.11(C:I2)
ROM2: IC5.19(!ROM2) IC21.9(C:I0) ; also sheet 3
ROM3: IC5.18(!ROM3) ; also sheet 3
ROM4: IC5.17(!ROM4) ; also sheet 3
ROM_CE: IC31.22(!CE) IC32.22(!CE) JP11.2
RW: IC4.9(R/W) IC5.55(R/!W) IC6.34(R/!W) IC8.31(R/!W) RN5.6 ; also sheet 1,3
SHCS: IC6.28(!CMPCS) IC8.38(!CS)
SNDCS: IC5.53(!SNDCS) ; also sheet 1
TOS1: IC21.8(C:O) JP11.3
TOS2: IC21.6(B:O) JP11.1
TOS_SW: IC31.30(A17) IC32.30(A17) JP12.2
UDS: IC4.7(UDS) IC5.47(!UDS) IC6.26(!UDS) RN5.8 ; also sheet 3
VCC: C5.1 C6.1 C8.1 C9.1 C10.1 C11.1 C12.1 C13.1 C14.1 C15.1 C16.1 C21.1 C22.1 C23.1 C24.1 C25.1 C26.1 C27.1 C28.1 C29.1 C30.1 C31.1 C32.1 C33.1 C34.+ C35.1 C44.1 C60.1 C61.+ C62.+ C63.+ C64.+ C65.1 C66.1 C67.+ C69.+ IC5.1(VCC) IC6.10(VCCA) IC6.44(VCCB) IC21.3(B:I0) IC31.31(!WE) IC31.32(VCC) IC32.31(!WE) IC32.32(VCC) JP9.17 JP9.19 JP12.1 L2.2 L4.2 R44.2 R45.2 R46.2 R76.1 RN3.1 RN4.1 RN5.1 RN6.1 RN7.1 RN8.1 RN9.1 T6.1(C) VGA.16 X1.14(VCC) ; also sheet 1,3
VMA: IC4.19(VMA) IC5.16(!VMA) RN9.4
VPA: IC4.21(VPA) IC5.29(!VPA) RN9.5
VSYNC: D10.C IC5.38(VSYNC) IC6.51(VSYNC) U$6.PIN12 VGA.14
WDAT: IC6.25(!WDAT) IC24.1(A:G) IC24.19(B:G) IC25.1(A:G) IC25.19(B:G)
WE: IC6.23(!WE) JP9.37
Unconnected: IC5.45(!BGO) IC21.1(A:I0) IC21.2(A:I1) IC21.12(A:O) IC21.13(A:I2) IC31.1(NC) IC32.1(NC) VGA.9 VGA.12 X1.S@1(S1) X1.S@2(S2)

### Notes on the sheet
- RAM | ROM | PULL-UP
- LO0 | HI0
- VIDEO

## Sheet 3 of 3
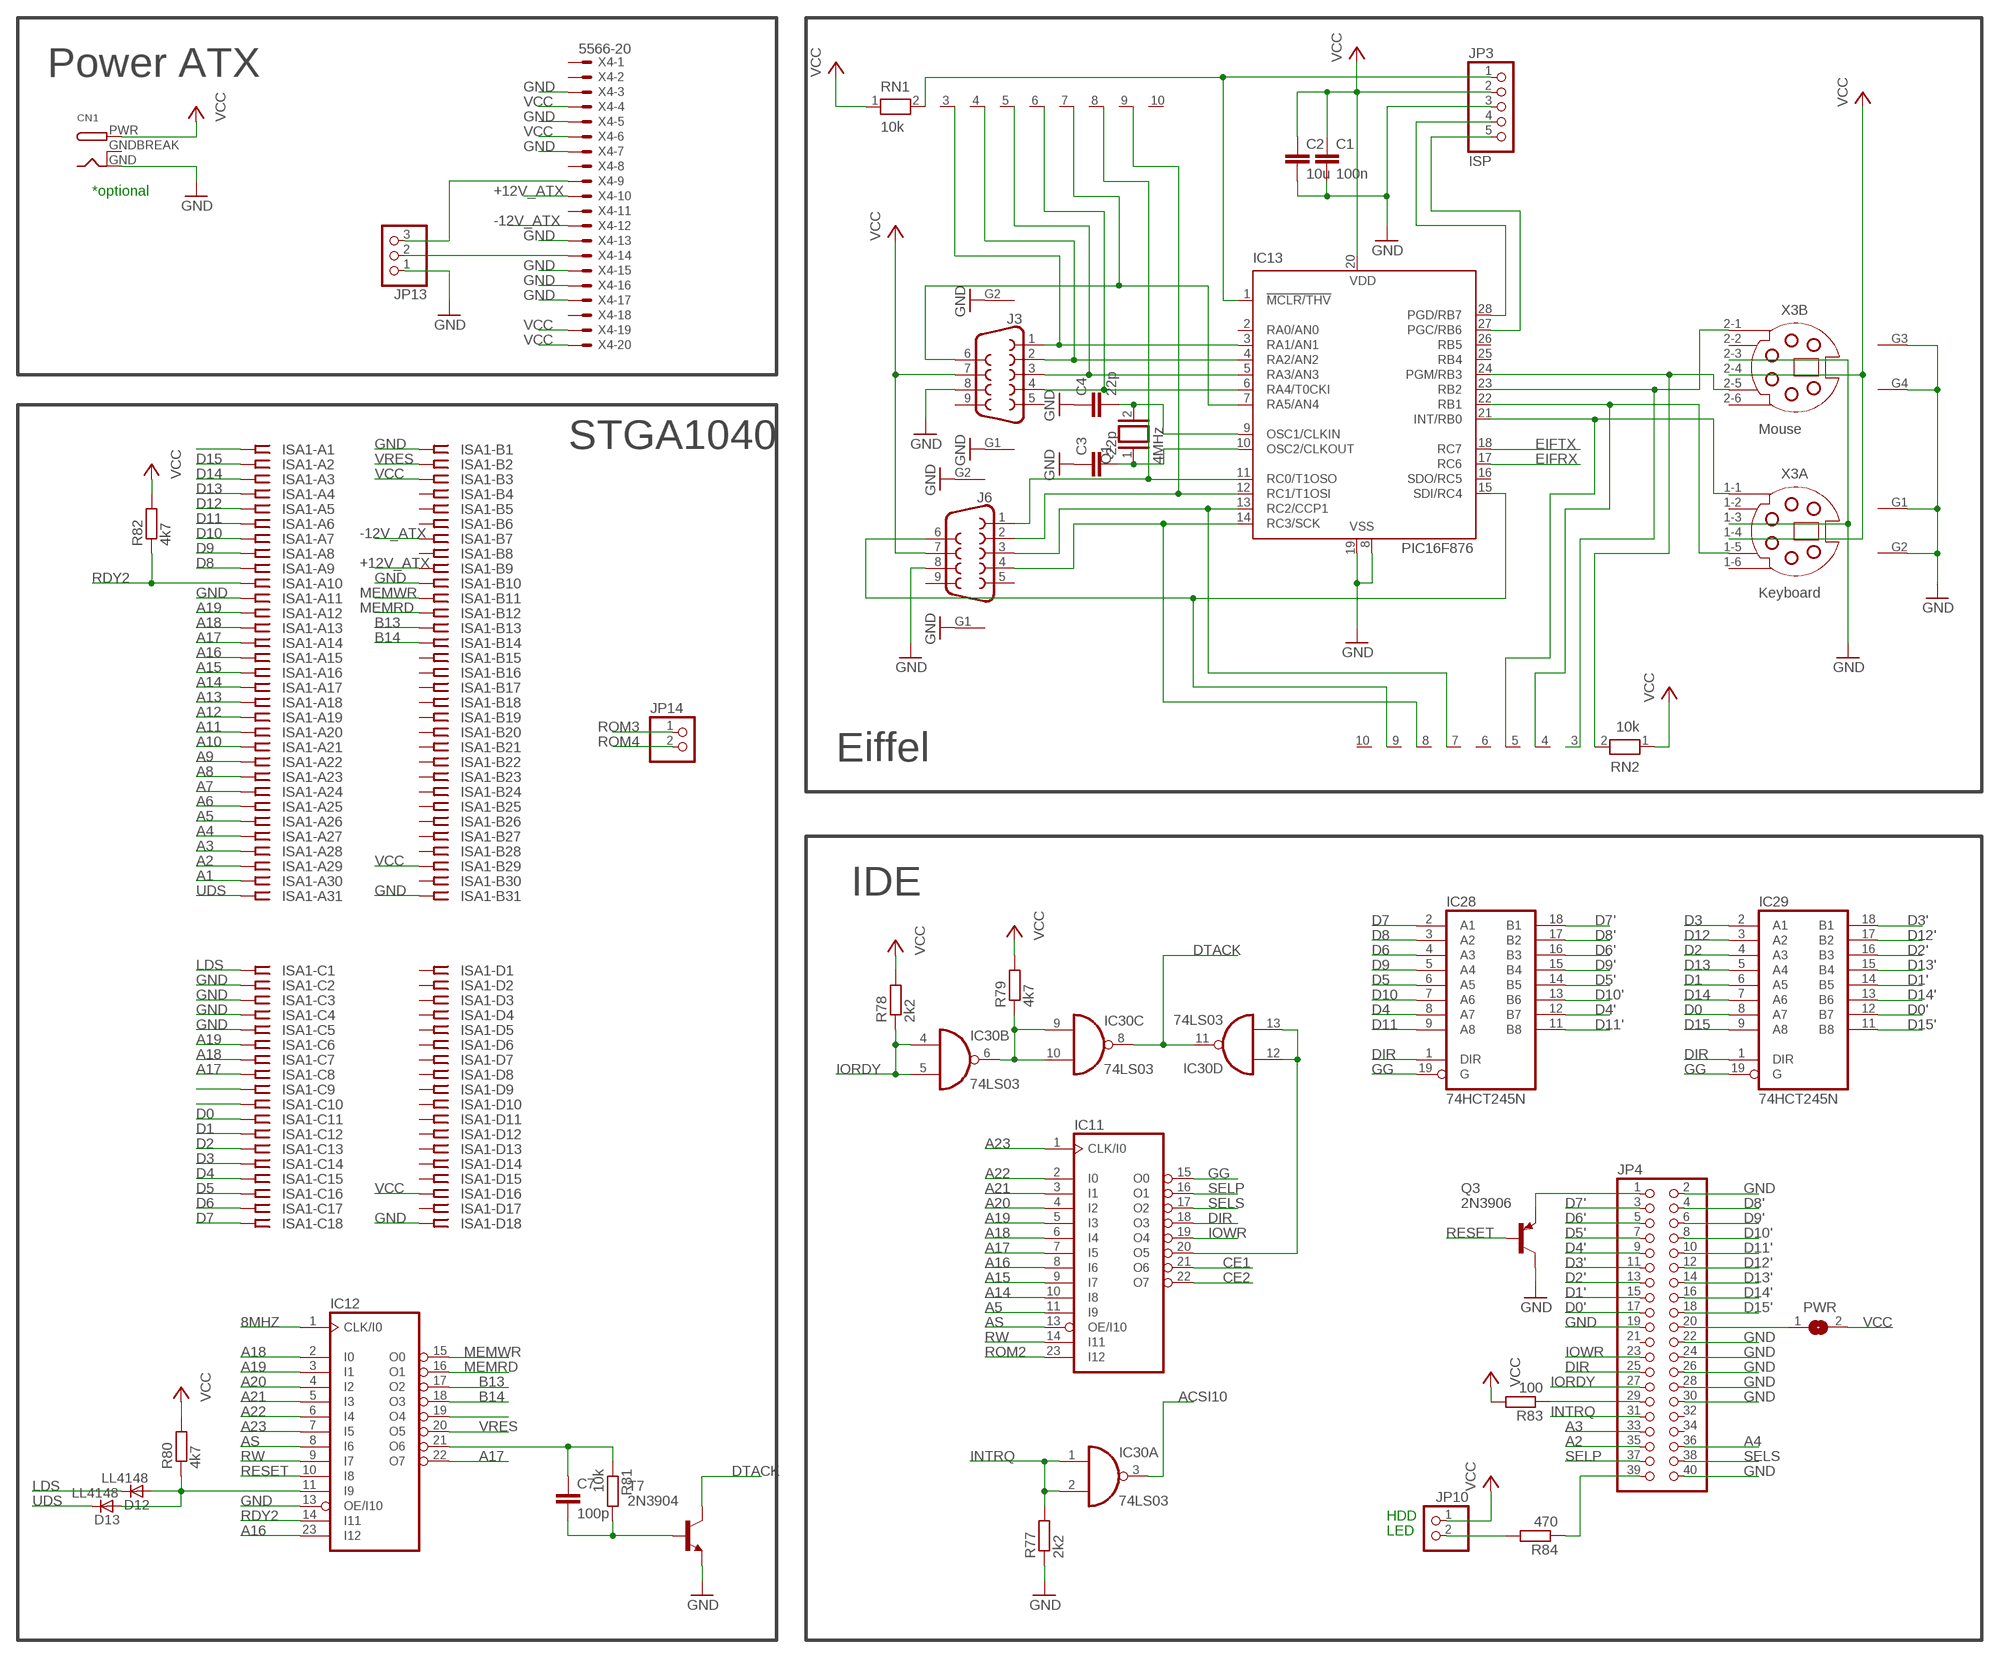
[diagram p4: schematic, sheet 3]

### Parts
C1  100n  C-EUC0805  [C0805]
C2  10u  C-EUC1206  [C1206]
C3  22p  C-EUC0805  [C0805]
C4  22p  C-EUC0805  [C0805]
C7  100p  C-EUC0805  [C0805]
CN1  DCBARRELPTH  [DCJACK_2MM_PTH]
D12  LL4148  [SOD80_DO213AA_MINIMELF]
D13  LL4148  [SOD80_DO213AA_MINIMELF]
IC11  20V8  [DIL24-3]
IC12  20V8  [DIL24-3]
IC13  PIC16F876  PIC16F872P  [DIL28-3]
IC28  74HCT245N  [DIL20]
IC29  74HCT245N  [DIL20]
IC30  74LS03  74ALS03D  [SO14]
ISA1  ISA-SLOT  [ISA-16]
J3  DB9MALE  [DB9_MALE]
J6  DB9MALE  [DB9_MALE]
JP3  ISP  PINHD-1X5  [1X05]
JP4  PINHD-2X20  [2X20]
JP10  PINHD-1X2  [1X02]
JP13  PINHD-1X3  [1X03]
JP14  PINHD-1X2  [1X02]
PWR  SJ  [SJ]
Q1  4MHz  XTAL/S  [QS]
Q3  2N3906  [TO92]
R77  2k2  R-EU_R0805  [R0805]
R78  2k2  R-EU_R0805  [R0805]
R79  4k7  R-EU_R0805  [R0805]
R80  4k7  R-EU_R0805  [R0805]
R81  10k  R-EU_R0805  [R0805]
R82  4k7  R-EU_R0805  [R0805]
R83  100  R-EU_R0805  [R0805]
R84  470  R-EU_R0805  [R0805]
RN1  10k  RN09  [RN-10]
RN2  10k  RN09  [RN-10]
T7  2N3904  [TO92]
X3  MDSSV-BD06  [SSV-BD06]
X4  5566-20  [5566-20]

### Nets
8MHZ: IC12.1(CLK/I0) ; also sheet 1,2
+12V_ATX: ISA1.B9 X4.10
-12V_ATX: ISA1.B7 X4.12
A1: ISA1.A30 ; also sheet 1,2
A2: ISA1.A29 JP4.35 ; also sheet 1,2
A3: ISA1.A28 JP4.33 ; also sheet 1,2
A4: ISA1.A27 JP4.36 ; also sheet 1,2
A5: IC11.11(I9) ISA1.A26 ; also sheet 1,2
A6: ISA1.A25 ; also sheet 2
A7: ISA1.A24 ; also sheet 2
A8: ISA1.A23 ; also sheet 2
A9: ISA1.A22 ; also sheet 2
A10: ISA1.A21 ; also sheet 2
A11: ISA1.A20 ; also sheet 2
A12: ISA1.A19 ; also sheet 2
A13: ISA1.A18 ; also sheet 2
A14: IC11.10(I8) ISA1.A17 ; also sheet 2
A15: IC11.9(I7) ISA1.A16 ; also sheet 2
A16: IC11.8(I6) IC12.23(I12) ISA1.A15 ; also sheet 2
A17: IC11.7(I5) IC12.22(O7) ISA1.A14 ISA1.C8 ; also sheet 2
A18: IC11.6(I4) IC12.2(I0) ISA1.A13 ISA1.C7 ; also sheet 2
A19: IC11.5(I3) IC12.3(I1) ISA1.A12 ISA1.C6 ; also sheet 2
A20: IC11.4(I2) IC12.4(I2) ; also sheet 2
A21: IC11.3(I1) IC12.5(I3) ; also sheet 2
A22: IC11.2(I0) IC12.6(I4) ; also sheet 2
A23: IC11.1(CLK/I0) IC12.7(I5) ; also sheet 2
ACSI10: IC30.3(A:O) ; also sheet 1
AS: IC11.13(OE/I10) IC12.8(I6) ; also sheet 2
B13: IC12.17(O2) ISA1.B13
B14: IC12.18(O3) ISA1.B14
CE1: IC11.21(O6) ; also sheet 2
CE2: IC11.22(O7) ; also sheet 2
D0: IC29.8(A7) ISA1.C11 ; also sheet 1,2
D0': IC29.12(B7) JP4.17
D1: IC29.6(A5) ISA1.C12 ; also sheet 1,2
D1': IC29.14(B5) JP4.15
D2: IC29.4(A3) ISA1.C13 ; also sheet 1,2
D2': IC29.16(B3) JP4.13
D3: IC29.2(A1) ISA1.C14 ; also sheet 1,2
D3': IC29.18(B1) JP4.11
D4: IC28.8(A7) ISA1.C15 ; also sheet 1,2
D4': IC28.12(B7) JP4.9
D5: IC28.6(A5) ISA1.C16 ; also sheet 1,2
D5': IC28.14(B5) JP4.7
D6: IC28.4(A3) ISA1.C17 ; also sheet 1,2
D6': IC28.16(B3) JP4.5
D7: IC28.2(A1) ISA1.C18 ; also sheet 1,2
D7': IC28.18(B1) JP4.3
D8: IC28.3(A2) ISA1.A9 ; also sheet 1,2
D8': IC28.17(B2) JP4.4
D9: IC28.5(A4) ISA1.A8 ; also sheet 1,2
D9': IC28.15(B4) JP4.6
D10: IC28.7(A6) ISA1.A7 ; also sheet 1,2
D10': IC28.13(B6) JP4.8
D11: IC28.9(A8) ISA1.A6 ; also sheet 1,2
D11': IC28.11(B8) JP4.10
D12: IC29.3(A2) ISA1.A5 ; also sheet 1,2
D12': IC29.17(B2) JP4.12
D13: IC29.5(A4) ISA1.A4 ; also sheet 1,2
D13': IC29.15(B4) JP4.14
D14: IC29.7(A6) ISA1.A3 ; also sheet 1,2
D14': IC29.13(B6) JP4.16
D15: IC29.9(A8) ISA1.A2 ; also sheet 1,2
D15': IC29.11(B8) JP4.18
DIR: IC11.18(O3) IC28.1(DIR) IC29.1(DIR) JP4.25
DTACK: IC30.8(C:O) IC30.11(D:O) T7.1(C) ; also sheet 1,2
EIFRX: IC13.17(RC6) ; also sheet 1
EIFTX: IC13.18(RC7) ; also sheet 1
GG: IC11.15(O0) IC28.19(G) IC29.19(G)
GND: C1.2 C2.2 C3.1 C4.1 CN1.GND IC12.13(OE/I10) IC13.8(VSS) IC13.19(VSS) ISA1.A11 ISA1.B1 ISA1.B10 ISA1.B31 ISA1.C2 ISA1.C3 ISA1.C4 ISA1.C5 ISA1.D18 J3.8 J3.G1 J3.G2 J6.8 J6.G1 J6.G2 JP3.3 JP4.2 JP4.19 JP4.22 JP4.24 JP4.26 JP4.28 JP4.30 JP4.40 JP13.1 Q3.1(C) R77.1 T7.3(E) X3.1-3 X3.2-3 X3.G1 X3.G2 X3.G3 X3.G4 X4.3 X4.5 X4.7 X4.13 X4.15 X4.16 X4.17 ; also sheet 1,2
INTRQ: IC30.1(A:I0) IC30.2(A:I1) JP4.31 R77.2
IORDY: IC30.4(B:I0) IC30.5(B:I1) JP4.27 R78.1
IOWR: IC11.19(O4) JP4.23
LDS: D12.C ISA1.C1 ; also sheet 1,2
MEMRD: IC12.16(O1) ISA1.B12
MEMWR: IC12.15(O0) ISA1.B11
N$1: IC13.1(!MCLR/THV) JP3.1 RN1.2
N$2: C3.2 IC13.10(OSC2/CLKOUT) Q1.1
N$3: IC13.28(PGD/RB7) JP3.4
N$4: IC13.27(PGC/RB6) JP3.5
N$5: C4.2 IC13.9(OSC1/CLKIN) Q1.2
N$7: IC13.3(RA1/AN1) J3.1 RN1.3
N$8: IC13.4(RA2/AN2) J3.2 RN1.4
N$9: IC13.5(RA3/AN3) J3.3 RN1.5
N$10: IC13.24(PGM/RB3) RN2.2 X3.2-5
N$11: IC13.22(RB1) RN2.4 X3.1-5
N$12: IC13.11(RC0/T1OSO) J6.1 RN1.8
N$13: IC13.12(RC1/T1OSI) J6.2 RN1.9
N$14: IC13.13(RC2/CCP1) J6.3 RN2.7
N$15: IC13.14(RC3/SCK) J6.4 RN2.8
N$16: IC13.15(SDI/RC4) J6.6 RN2.9
N$19: IC13.23(RB2) RN2.3 X3.2-1
N$20: IC13.21(INT/RB0) RN2.5 X3.1-1
N$26: IC13.7(RA5/AN4) J3.6 RN1.7
N$29: IC13.6(RA4/T0CKI) J3.4 RN1.6
N$68: IC30.6(B:O) IC30.9(C:I0) IC30.10(C:I1) R79.1
N$104: JP4.39 R84.1
N$111: IC11.20(O5) IC30.12(D:I0) IC30.13(D:I1)
N$130: JP4.29 R83.1
N$132: JP4.20 PWR.1
N$134: JP4.1 Q3.3(E)
N$135: D12.A D13.A IC12.11(I9) R80.1
N$136: C7.2 R81.2 T7.2(B)
N$137: ISA1.A1
N$138: JP10.2 R84.2
N$139: JP13.2 X4.14
N$141: JP13.3 X4.9
N$154: IC12.19(O4)
N$156: C7.1 IC12.21(O6) R81.1
N$181: ISA1.C9
N$182: ISA1.C10
RDY2: IC12.14(I11) ISA1.A10 R82.1
RESET: IC12.10(I8) Q3.2(B) ; also sheet 1,2
ROM2: IC11.23(I12) ; also sheet 2
ROM3: JP14.1 ; also sheet 2
ROM4: JP14.2 ; also sheet 2
RW: IC11.14(I11) IC12.9(I7) ; also sheet 1,2
SELP: IC11.16(O1) JP4.37
SELS: IC11.17(O2) JP4.38
UDS: D13.C ISA1.A31 ; also sheet 2
VCC: C1.1 C2.1 CN1.PWR IC13.20(VDD) ISA1.B3 ISA1.B29 ISA1.D16 J3.7 J6.7 JP3.2 JP10.1 PWR.2 R78.2 R79.2 R80.2 R82.2 R83.2 RN1.1 RN2.1 X3.1-4 X3.2-4 X4.4 X4.6 X4.19 X4.20 ; also sheet 1,2
VRES: IC12.20(O5) ISA1.B2
Unconnected: IC13.2(RA0/AN0) IC13.16(SDO/RC5) IC13.25(RB4) IC13.26(RB5) ISA1.B4 ISA1.B5 ISA1.B6 ISA1.B8 ISA1.B15 ISA1.B16 ISA1.B17 ISA1.B18 ISA1.B19 ISA1.B20 ISA1.B21 ISA1.B22 ISA1.B23 ISA1.B24 ISA1.B25 ISA1.B26 ISA1.B27 ISA1.B28 ISA1.B30 ISA1.D1 ISA1.D2 ISA1.D3 ISA1.D4 ISA1.D5 ISA1.D6 ISA1.D7 ISA1.D8 ISA1.D9 ISA1.D10 ISA1.D11 ISA1.D12 ISA1.D13 ISA1.D14 ISA1.D15 ISA1.D17 J3.5 J3.9 J6.5 J6.9 JP4.21 JP4.32 JP4.34 RN1.10 RN2.6 RN2.10 X3.1-2 X3.1-6 X3.2-2 X3.2-6 X4.1 X4.2 X4.8 X4.11 X4.18

### Notes on the sheet
- Power ATX
- *optional
- Mouse
- STGA1040
- Keyboard
- Eiffel
- IDE
- HDD
- LED

## Power pins joined to a net without a drawn wire
2: J5.2
GND: IC3.36(GND) IC4.16(GND) IC4.53(GND) IC11.12(GND) IC12.12(GND) IC14.7(P:GND) IC15.7(P:GND) IC16.7(P:GND) IC18.7(P:GND) IC19.7(P:GND) IC20.7(P:GND) IC21.7(P:GND) IC22.10(GND) IC23.10(GND) IC24.10(P:GND) IC25.10(P:GND) IC28.10(GND) IC29.10(GND) IC30.7(P:GND) IC33.3(GND)
GNDBREAK: CN1.GNDBREAK
VCC: IC3.11(VCC) IC4.14(VCC) IC4.49(VCC) IC11.24(VCC) IC12.24(VCC) IC14.14(P:VCC) IC15.14(P:VCC) IC16.14(P:VCC) IC18.14(P:VCC) IC19.14(P:VCC) IC20.14(P:VCC) IC21.14(P:VCC) IC22.20(VCC) IC23.20(VCC) IC24.20(P:VCC) IC25.20(P:VCC) IC28.20(VCC) IC29.20(VCC) IC30.14(P:VCC) IC33.5(VCC)

## Library data of the parts
C1-C33 C35-C37 C39-C49 C53-C57 C59 C60 C65 C66 C70-C72 = rcl:C-EU: CAPACITOR, European symbol
C34 C38 C50-C52 C58 C61-C64 C67-C69 = rcl:CPOL-EU: POLARIZED CAPACITOR, European symbol
CN1 = adafruit:DCBARREL: 2.0mm DC Barrel Jack DCJACK_2MM_PTH - Through Hole Jack (4UConnector: 05537)
D1 = diode:BAV17: DIODE silicon-epitaxial planar diode
D2-D13 = _hhn_diodes_smd:LL4148: 1N4148 General Purpose Rectifie SMD-Version of 1N4148 Case: SOD 80 = DO 213 AA = MINIMELF (Glass) Author: Dipl.-Ing. FH Rainer Bayer HHN Hochschule Heilbronn, rainer.bayer@hs-heilbronn.de Ingenieurbüro ing-rb, mail@ing-rb.de
IC1 IC2 = micro-motorola:6850: MICROCONTROLLER/MEMORY DEVICE; MF: NTE ELECTRONICS; MPN: NTE6850; OC_FARNELL: 4899775; OC_NEWARK: 31C2457
IC3 = micro-mc68000:MC68901P: 68xxx PROCESSOR; OC_FARNELL: unknown; OC_NEWARK: unknown
IC4 = micro-mc68000:MC68000P: 68xxx PROCESSOR; OC_FARNELL: unknown; OC_NEWARK: unknown
IC5 = AtariST:GLUE
IC6 = AtariST:MMU
IC7 = AtariST:YM2149
IC8 = AtariST:SHIFTER
IC9 = AtariST:DMA
IC10 = WD1772:WD1772
IC11 IC12 = pal:20V8: PAL; MF: FARNELL; MPN: GAL20V8B-25QP; OC_FARNELL: 3327462; OC_NEWARK: 70C8546
IC13 = microchip:PIC16*872: MICROCONTROLLER flash type; MF: MICROCHIP; MPN: PIC16F872-I/SP; OC_FARNELL: 9761012; OC_NEWARK: 12C1945
IC14 = 74xx-eu:74*04: Hex INVERTER
IC15 = 74xx-eu:74*05: Hex INVERTER, open collector
IC16 = 74xx-eu:74*02: Quad 2-input NOR gate
IC17 = 1488 1489:14*88: Quad 2-input NAND gate
IC18 = 1488 1489:14*89: Quad line receivers BUFFER,
IC19 IC20 = 74xx-eu:74*06: Hex INVERTER, open collector high-voltage output
IC21 = 74xx-eu:74*11: Triple 3-input AND gate
IC22 IC23 = 74xx-eu:74*373: Octal D type transparent LATCH, edge triggered
IC24 IC25 = 74xx-eu:74*244: Octal BUFFER and LINE DRIVER, 3-state
IC26 = st-microelectronics:NE556: General Purpose Biopolartimer; MPN: NE556; OC_FARNELL: 2349784; OC_NEWARK: 83C0108
IC27 = TL497:TL497: TL497 from Atari ST Computer
IC28 IC29 = 74xx-eu:74*245: Octal BUS TRANSCEIVER, 3-state
IC30 = 74xx-eu:74*03: Quad 2-input NAND gate, open collector output
IC31 IC32 = 39SF020:39SF020
IC33 = 74xx-little-de:74*1G04: INVERTER Gate
ISA1 = con-pc:ISA-SLOT: ISA SLOT
J1 = SparkFun-Connectors:AUDIO_JACK_3.5MM: Audio Jack 3.5mm variants of PTH and SMT stereo audio jack with bypass switches. SparkFun Products: SparkFun SparkPunk Sound Kit <[https://www.sparkfun.com/products/11177]> - PTH MP3 Trigger <https://www.sparkfun.com/products/13720> -3.5mm SMD SparkFun PicoBoard <https://www.sparkfun.com/products/11888>- 2.5mm SMD; PROD_ID: CONN-08774; SF_ID: PRT-08032
J3 J6 = SparkFun-Connectors:DB9: DB9 Connector Standard DB9 (D-Sub 9) serial connector. Can be used for CAN bus as well as RS485 and RS232. Footprint production proven. Here is the female version connector we sell at SparkFun: 9 Pin Female Serial Connector - PCB Mount <https://www.sparkfun.com/products/429> (PRT-00429) This connector has been used on the following SparkFun products: SparkFun RS232 Shifter - SMD <https://www.sparkfun.com/products/449> (PRT-00449) SparkFun RS232 Shifter SMD (No DB9) <https://www.sparkfun.com/products/8780> (PRT-08780); PROD_ID: CONN-09904
J4 J5 = DIN5:DIN5
JP1 JP2 JP10 JP14 = pinhead:PINHD-1X2: PIN HEADER
JP3 = pinhead:PINHD-1X5: PIN HEADER
JP4 JP9 = pinhead:PINHD-2X20: PIN HEADER
JP5 = pinhead:PINHD-2X17: PIN HEADER
JP6 = pinhead:PINHD-2X10: PIN HEADER
JP7 JP8 = pinhead:PINHD-2X13: PIN HEADER
JP11-JP13 = pinhead:PINHD-1X3: PIN HEADER
L1-L5 = rcl:L-EU: INDUCTOR, European symbol
OK1 = optocoupler:H11L*M: 6-Pin DIP Optocoupler Source: http://www.fairchildsemi.com/ds/H1/H11L2-M.pdf; MF: FAIRCHILD SEMICONDUCTOR; MPN: H11L1-M; OC_FARNELL: 1021127; OC_NEWARK: 72K8643
PWR = jumper:SJ: SMD solder JUMPER
Q1 Q2 X2 = special:XTAL/S: CRYSTAL
Q3 = transistor-pnp:2N3906: PNP Transistor
R1-R85 = rcl:R-EU_: RESISTOR, European symbol
RN1 RN2 RN10 = resistor-net:RN09: RESISTOR NETWORK; OC_FARNELL: unknown; OC_NEWARK: unknown
RN3-RN9 = resistor-net:RN08: RESISTOR NETWORK; OC_FARNELL: unknown; OC_NEWARK: unknown
T1-T7 = transistor:2N3904: NPN TRANSISTOR
U$6 = 13PINDIN:13-DIN: Right-angled mountable 13-pin DIN socket for multichannel (MIDI) guitar circuits.
VGA = pinhead:PINHD-2X8: PIN HEADER
X1 = crystal:TC46: Temperature Compensated Xtal Oscillator HCMOS, Clipped Sine Wave or Sine Wave Compatible Source: www.pletronics.com .. tc4.pdf; OC_FARNELL: unknown; OC_NEWARK: unknown
X3 = con-yamaichi:MDSSV-BD06: YAMAICHI CONNECTOR; OC_FARNELL: unknown; OC_NEWARK: unknown
X4 = con-molex:5566-20: Mini FIT connector 20 pol ATX PC-Motherboard Power connector Source: http://www.molex.com; OC_FARNELL: unknown; OC_NEWARK: unknown